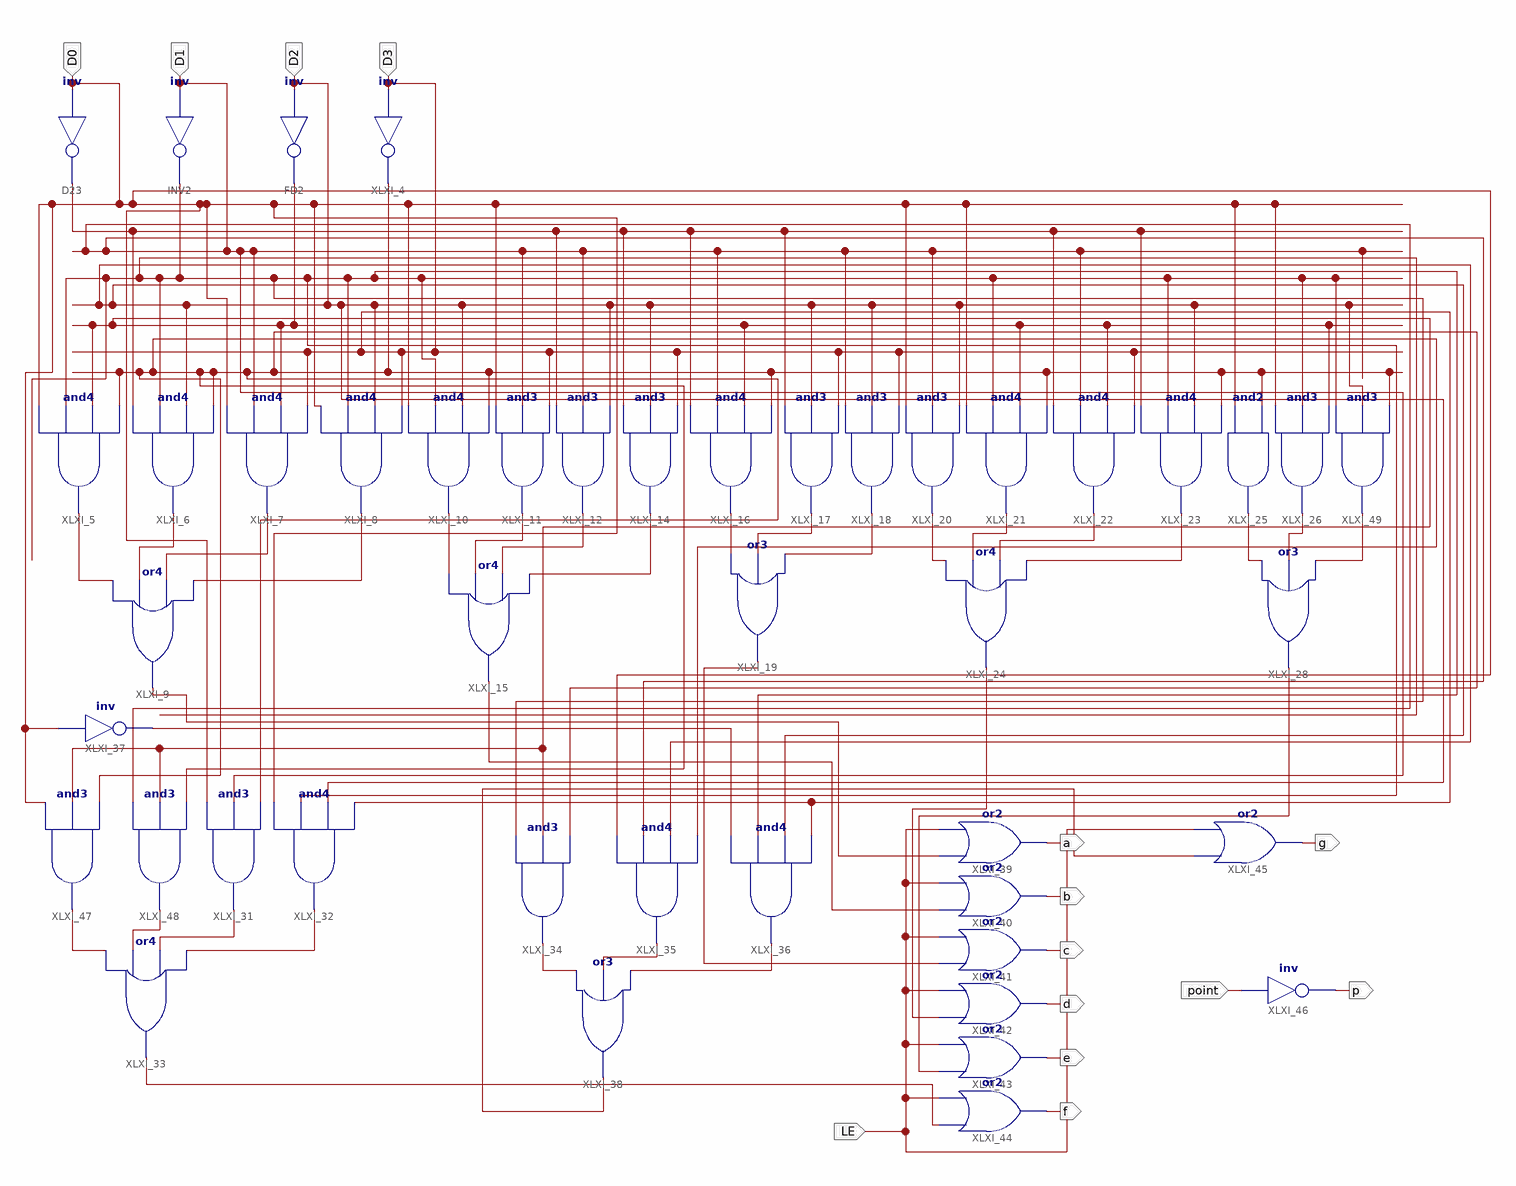
[diagram p0: schematic sheet 1]
// Xilinx ISE schematic MC14495_ZJU.sch (kintex7) as structural Verilog: 45 symbols, 14 ports
module MC14495_ZJU (
  input  D1,
  input  D2,
  input  D3,
  input  D0,
  input  LE,
  input  point,
  output a,
  output b,
  output c,
  output d,
  output e,
  output f,
  output g,
  output p
);

  wire ND0, ND1, ND2, ND3, XLXN_16, XLXN_17, XLXN_18, XLXN_19, XLXN_21, XLXN_22, XLXN_24, XLXN_25, XLXN_26,
       XLXN_27, XLXN_28, XLXN_29, XLXN_30, XLXN_31, XLXN_32, XLXN_33, XLXN_34, XLXN_35, XLXN_45, XLXN_46,
       XLXN_47, XLXN_48, XLXN_53, XLXN_54, XLXN_55, XLXN_56, XLXN_58, XLXN_59, XLXN_60, XLXN_61, XLXN_63,
       XLXN_65, XLXN_66;

  not D23 (ND0, D0);
  not INV2 (ND1, D1);
  not FD2 (ND2, D2);
  not XLXI_4 (ND3, D3);
  and XLXI_5 (XLXN_16, D0, ND1, ND2, ND3);
  and XLXI_6 (XLXN_17, ND0, ND1, D2, ND3);
  and XLXI_7 (XLXN_18, D0, D1, ND2, D3);
  and XLXI_8 (XLXN_19, D0, ND1, D2, D3);
  or XLXI_9 (XLXN_58, XLXN_16, XLXN_17, XLXN_18, XLXN_19);
  and XLXI_10 (XLXN_21, D0, ND1, D2, ND3);
  and XLXI_11 (XLXN_22, D0, D1, D3);
  and XLXI_12 (XLXN_24, ND0, D1, D2);
  and XLXI_14 (XLXN_25, ND0, D2, D3);
  or XLXI_15 (XLXN_59, XLXN_21, XLXN_22, XLXN_24, XLXN_25);
  and XLXI_16 (XLXN_26, ND0, D1, ND2, ND3);
  and XLXI_17 (XLXN_27, ND0, D2, D3);
  and XLXI_18 (XLXN_28, D1, D2, D3);
  or XLXI_19 (XLXN_60, XLXN_26, XLXN_27, XLXN_28);
  and XLXI_20 (XLXN_29, D0, D1, D2);
  and XLXI_21 (XLXN_30, D0, ND1, ND2, ND3);
  and XLXI_22 (XLXN_31, ND0, D1, ND2, D3);
  and XLXI_23 (XLXN_32, ND0, ND1, D2, ND3);
  or XLXI_24 (XLXN_61, XLXN_29, XLXN_30, XLXN_31, XLXN_32);
  and XLXI_25 (XLXN_33, D0, ND3);
  and XLXI_26 (XLXN_34, D0, ND1, ND2);
  or XLXI_28 (XLXN_63, XLXN_33, XLXN_34, XLXN_35);
  and XLXI_31 (XLXN_47, D0, D1, ND3);
  and XLXI_32 (XLXN_48, D0, ND1, D2, D3);
  or XLXI_33 (XLXN_65, XLXN_45, XLXN_46, XLXN_47, XLXN_48);
  and XLXI_34 (XLXN_54, ND1, ND2, ND3);
  and XLXI_35 (XLXN_55, D0, D1, D2, ND3);
  and XLXI_36 (XLXN_56, XLXN_53, ND1, D2, D3);
  not XLXI_37 (XLXN_53, D0);
  or XLXI_38 (XLXN_66, XLXN_54, XLXN_55, XLXN_56);
  or XLXI_39 (a, XLXN_58, LE);
  or XLXI_40 (b, XLXN_59, LE);
  or XLXI_41 (c, XLXN_60, LE);
  or XLXI_42 (d, XLXN_61, LE);
  or XLXI_43 (e, XLXN_63, LE);
  or XLXI_44 (f, XLXN_65, LE);
  or XLXI_45 (g, XLXN_66, LE);
  not XLXI_46 (p, point);
  and XLXI_47 (XLXN_45, D0, ND2, ND3);
  and XLXI_48 (XLXN_46, D1, ND2, ND3);
  and XLXI_49 (XLXN_35, ND1, D2, ND3);
endmodule
